# Altium schematic sheet R2.SchDoc
size A3; SheetNumber: 1; SheetTotal: 1
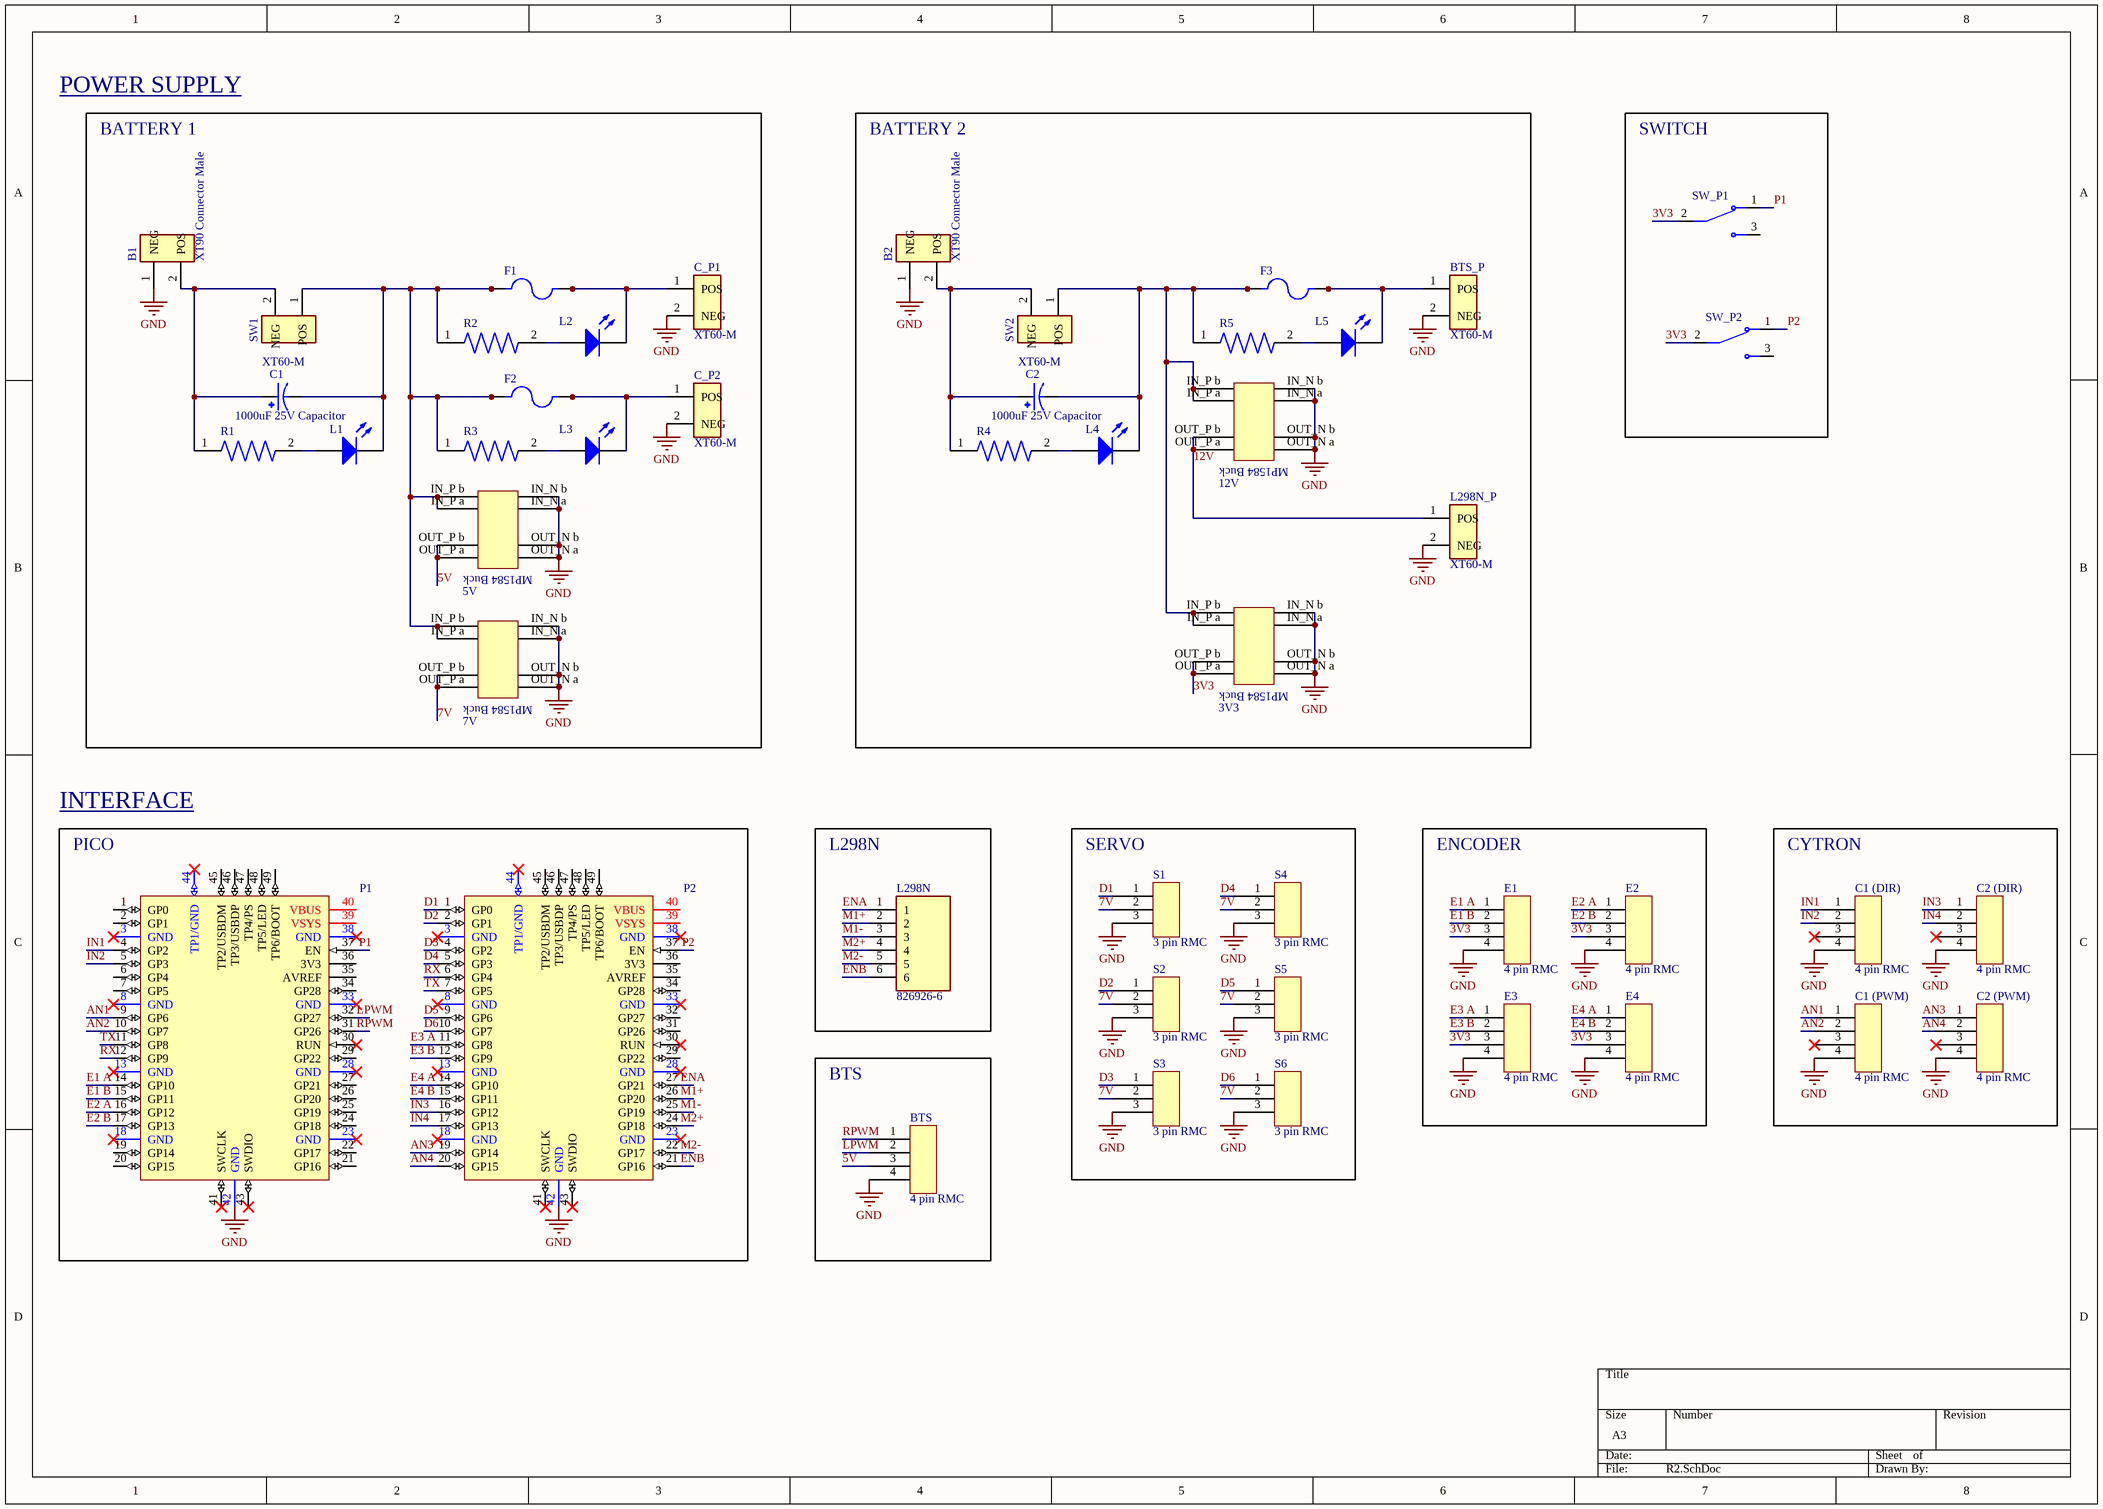
[diagram p0: R2.SchDoc]

## Parts
3V3  MP1584 mini buck module  [mp1584 mini buck]  (value not drawn)
5V  MP1584 mini buck module  [mp1584 mini buck]  (value not drawn)
7V  MP1584 mini buck module  [mp1584 mini buck]  (value not drawn)
12V  MP1584 mini buck module  [mp1584 mini buck]  (value not drawn)
B1  XT90-M  [XT90-M]  (value not drawn)
B2  XT90-M  [XT90-M]  (value not drawn)
BTS  4 pin RMC  [Header JST 1X04]
BTS_P  XT60-M  [XT-60M]
C1  1000uF 25V Capacitor  [1000uF 25V Capacitor]
C1_(DIR)  4 pin RMC  [Header JST 1X04]
C1_(PWM)  4 pin RMC  [Header JST 1X04]
C2  1000uF 25V Capacitor  [1000uF 25V Capacitor]
C2_(DIR)  4 pin RMC  [Header JST 1X04]
C2_(PWM)  4 pin RMC  [Header JST 1X04]
C_P1  XT60-M  [XT-60M]
C_P2  XT60-M  [XT-60M]
E1  4 pin RMC  [Header JST 1X04]
E2  4 pin RMC  [Header JST 1X04]
E3  4 pin RMC  [Header JST 1X04]
E4  4 pin RMC  [Header JST 1X04]
F1  3522-2  [FUSE_3522-2]  (value not drawn)
F2  3522-2  [FUSE_3522-2]  (value not drawn)
F3  3522-2  [FUSE_3522-2]  (value not drawn)
L1  151031SS04000 LED  [LED Type 3mm]  (value not drawn)
L2  151031SS04000 LED  [LED Type 3mm]  (value not drawn)
L3  151031SS04000 LED  [LED Type 3mm]  (value not drawn)
L4  151031SS04000 LED  [LED Type 3mm]  (value not drawn)
L5  151031SS04000 LED  [LED Type 3mm]  (value not drawn)
L298N  826926-6  [TE_826926-6]
L298N_P  XT60-M  [XT-60M]
P1  RPI-PICO-MOD  [RPI-PICO-MOD]  (value not drawn)
P2  RPI-PICO-MOD  [RPI-PICO-MOD]  (value not drawn)
R1  2-1623927-3  [RESAD700W45L350D185]  (value not drawn)
R2  2-1623927-3  [RESAD700W45L350D185]  (value not drawn)
R3  2-1623927-3  [RESAD700W45L350D185]  (value not drawn)
R4  2-1623927-3  [RESAD700W45L350D185]  (value not drawn)
R5  2-1623927-3  [RESAD700W45L350D185]  (value not drawn)
S1  3 pin RMC  [Header JST 1X03]
S2  3 pin RMC  [Header JST 1X03]
S3  3 pin RMC  [Header JST 1X03]
S4  3 pin RMC  [Header JST 1X03]
S5  3 pin RMC  [Header JST 1X03]
S6  3 pin RMC  [Header JST 1X03]
SW1  XT60-M  [XT-60M]
SW2  XT60-M  [XT-60M]
SW_P1  500SSP1S2M2QEA  [SW_500SSP1S2M2QEA]  (value not drawn)
SW_P2  500SSP1S2M2QEA  [SW_500SSP1S2M2QEA]  (value not drawn)

## Blocks framed on the sheet
BATTERY 1: 5V 7V B1 C1 C_P1 C_P2 F1 F2 L1-L3 R1-R3 SW1
BATTERY 2: 3V3 12V B2 BTS_P C2 F3 L4 L5 L298N_P R4 R5 SW2
SWITCH: SW_P1 SW_P2
INTERFACE: P1 P2
L298N: L298N
SERVO: S1-S6
ENCODER: E1-E4
CYTRON: C1_(DIR) C1_(PWM) C2_(DIR) C2_(PWM)
BTS: BTS

## Nets
GND: 3V3.IN_N_a 3V3.IN_N_b 3V3.OUT_N_a 3V3.OUT_N_b 5V.IN_N_a 5V.IN_N_b 5V.OUT_N_a 5V.OUT_N_b 7V.IN_N_a 7V.IN_N_b 7V.OUT_N_a 7V.OUT_N_b 12V.IN_N_a 12V.IN_N_b 12V.OUT_N_a 12V.OUT_N_b B1.1(NEG) B2.1(NEG) BTS.4 BTS_P.2(NEG) C1_(DIR).4 C1_(PWM).4 C2_(DIR).4 C2_(PWM).4 C_P1.2(NEG) C_P2.2(NEG) E1.4 E2.4 E3.4 E4.4 L298N_P.2(NEG) P1.42(GND) P2.42(GND) S1.3 S2.3 S3.3 S4.3 S5.3 S6.3
3V3: 3V3.OUT_P_a(OUT_P_b) 3V3.OUT_P_b E1.3 E2.3 E3.3 E4.3 SW_P1.2(COM) SW_P2.2(COM)
5V: 5V.OUT_P_a(OUT_P_b) 5V.OUT_P_b BTS.3
7V: 7V.OUT_P_a(OUT_P_b) 7V.OUT_P_b S1.2 S2.2 S3.2 S4.2 S5.2 S6.2
12V: 12V.OUT_P_a(OUT_P_b) 12V.OUT_P_b L298N_P.1(POS)
AN1: C1_(PWM).1 P1.9(GP6)
AN2: C1_(PWM).2 P1.10(GP7)
AN3: C2_(PWM).1 P2.19(GP14)
AN4: C2_(PWM).2 P2.20(GP15)
D1: P2.1(GP0) S1.1
D2: P2.2(GP1) S2.1
D3: P2.4(GP2) S3.1
D4: P2.5(GP3) S4.1
D5: P2.9(GP6) S5.1
D6: P2.10(GP7) S6.1
E1 A: E1.1 P1.14(GP10)
E1 B: E1.2 P1.15(GP11)
E2 A: E2.1 P1.16(GP12)
E2 B: E2.2 P1.17(GP13)
E3 A: E3.1 P2.11(GP8)
E3 B: E3.2 P2.12(GP9)
E4 A: E4.1 P2.14(GP10)
E4 B: E4.2 P2.15(GP11)
ENA: L298N.1 P2.27(GP21)
ENB: L298N.6 P2.21(GP16)
IN1: C1_(DIR).1 P1.4(GP2)
IN2: C1_(DIR).2 P1.5(GP3)
IN3: C2_(DIR).1 P2.16(GP12)
IN4: C2_(DIR).2 P2.17(GP13)
LPWM: BTS.2 P1.32(GP27)
M1+: L298N.2 P2.26(GP20)
M1-: L298N.3 P2.25(GP19)
M2+: L298N.4 P2.24(GP18)
M2-: L298N.5 P2.22(GP17)
P1: P1.37(EN) SW_P1.1(NC)
P2: P2.37(EN) SW_P2.1(NC)
RPWM: BTS.1 P1.31(GP26)
RX: P1.12(GP9) P2.6(GP4)
TX: P1.11(GP8) P2.7(GP5)
Net3V3_IN_P a: 3V3.IN_P_a 3V3.IN_P_b 12V.IN_P_a 12V.IN_P_b C2.N F3.1A F3.1B L4.1(K) R5.1 SW2.1(POS)
Net5V_IN_P a: 5V.IN_P_a 5V.IN_P_b 7V.IN_P_a 7V.IN_P_b C1.N F1.1A F1.1B F2.1A F2.1B L1.1(K) R2.1 R3.1 SW1.1(POS)
NetB1_2: B1.2(POS) C1.P R1.1 SW1.2(NEG)
NetB2_2: B2.2(POS) C2.P R4.1 SW2.2(NEG)
NetBTS_P_1: BTS_P.1(POS) F3.2A F3.2B L5.1(K)
NetC_P1_1: C_P1.1(POS) F1.2A F1.2B L2.1(K)
NetC_P2_1: C_P2.1(POS) F2.2A F2.2B L3.1(K)
NetL1_2: L1.2(A) R1.2
NetL2_2: L2.2(A) R2.2
NetL3_2: L3.2(A) R3.2
NetL4_2: L4.2(A) R4.2
NetL5_2: L5.2(A) R5.2

Not connected (* = marked no-connect by the designer): C1_(DIR) 3*; C1_(PWM) 3*; C2_(DIR) 3*; C2_(PWM) 3*; P1 1(GP0) 2(GP1) 3(GND)* 6(GP4) 7(GP5) 8(GND)* 13(GND)* 18(GND)* 19(GP14) 20(GP15) 21(GP16) 22(GP17) 23(GND)* 24(GP18) 25(GP19) 26(GP20) 27(GP21) 28(GND)* 29(GP22) 30(RUN)* 33(GND)* 34(GP28) 35(AVREF) 36(3V3) 38(GND)* 39(VSYS) 40(VBUS) 41(SWCLK)* 43(SWDIO)* 44(TP1/GND)* 45(TP2/USBDM) 46(TP3/USBDP) 47(TP4/PS) 48(TP5/LED) 49(TP6/BOOT); P2 3(GND)* 8(GND)* 13(GND)* 18(GND)* 23(GND)* 28(GND)* 29(GP22) 30(RUN)* 31(GP26) 32(GP27) 33(GND)* 34(GP28) 35(AVREF) 36(3V3) 38(GND)* 39(VSYS) 40(VBUS) 41(SWCLK)* 43(SWDIO)* 44(TP1/GND)* 45(TP2/USBDM) 46(TP3/USBDP) 47(TP4/PS) 48(TP5/LED) 49(TP6/BOOT); SW_P1 3(NO); SW_P2 3(NO)

## Notes on the sheet
- POWER SUPPLY
- (near P1) PICO
- (in symbol MP1584 mini buck module) MP1584 Buck
- (in symbol XT90-M) XT90 Connector Male

## Library data of the parts
BTS_P C_P1 C_P2 L298N_P SW1 SW2 = XT60-M: Plug; DC supply; XT60; male; PIN: 2; for cable; soldered; 30A; 500V; MF: AMASS; MP: XT60-M; Price: None; Package: Package Analog Devices; Value: *; Availability: Unavailable; SnapEDA_Link: https://www.snapeda.com/parts/XT60-M/AMASS/view-part/2883912/?ref=snap
C1 C2 = 1000uF 25V Capacitor: CAP ALUM 1000UF 20% 25V RADIAL; MP: EEUTA1E102LB; MF: Panasonic; Package: RADIAL-2 Panasonic; Availability: No availability data; Price: None; Check_prices: https://www.snapeda.com/parts/EEUTA1E102LB/Panasonic/view-part/5789306/?ref=eda; SnapEDA_Link: https://www.snapeda.com/parts/EEUTA1E102LB/Panasonic/view-part/5789306/?ref=snap; Value: *
F1-F3 = 3522-2: MF: {'manufacturer': u'Keystone Electronics'}; Availability: Unavailable; Price: None; Value: *; MP: 3522-2; Package: None
L1-L5 = 151031SS04000 LED: THT LED round mono-color color lens, WL-TMRW, Super Red; PackageReference: Type 3mm; Emitting color: Super Red; PartNumber: 151031SS04000; ComponentLink1Description: Manufacturer URL; ComponentLink1URL: http://www.we-online.com; ComponentLink2Description: Datasheet; ComponentLink2URL: http://katalog.we-online.de/pbs/datasheet/7448042001.pdfhttp://katalog.we-online.de/pbs/datasheet/7448042001.pdfhttp://katalog.we-online.de/pbs/datasheet/7448042001.pdfhttp://katalog.we-online.de/pbs/datasheet/151031SS04000.pdf
L298N = 826926-6: 6P AMPMODU II STIFT LEI; Centerline_Pitch: 2.54 mm[.1 in]; Product_Type: Connector; MF: TE Connectivity; Number_of_Positions: 6; MP: 826926-6; Availability: Unavailable; EU_RoHS_Compliance: Compliant; Package: None; Value: *; TE_purchase_URL: https://www.te.com/usa-en/product-826926-6.html?te_bu=Cor&te_type=disp&te_campaign=seda_glo_cor-seda-global-disp-prtnr-fy19-seda-model-bom-cta_sma-317_1&elqCampaignId=32493; Price: None; SnapEDA_Link: https://www.snapeda.com/parts/826926-6/TE%20Connectivity%20AMP%20Connectors/view-part/481382/?ref=snap
P1 P2 = RPI-PICO-MOD: RASPBERRY PI PICO RP2040 BOARD; Manufacturer: Raspberry Pi Foundation; Manufacturer Part No: SC0915; Mounting Technology: SMT; Supplier: DigiKey; Supplier Part No: 2648-SC0915CT-ND; Supplier Link: https://www.digikey.com/en/products/detail/raspberry-pi/SC0915/13684020
R1-R5 = 2-1623927-3: Carbon Film Resistors - Through Hole 1K Ohm 5% 1/4W Res Carbon Film; Voltage_Rating: 200 V; MF: TE Connectivity; Power_Rating: .25 W; Value: *; Tolerance: 5%; SnapEDA_Link: https://www.snapeda.com/parts/2-1623927-3/TE+Connectivity/view-part/?ref=snap; Resistance: 1K; Purchase-URL: https://pricing.snapeda.com/search/part/2-1623927-3/?ref=eda; EU_RoHS_Compliance: Compliant; Availability: In Stock; Price: None; Package: None; Check_prices: https://www.snapeda.com/parts/2-1623927-3/TE+Connectivity/view-part/?ref=eda; MP: 2-1623927-3
SW_P1 SW_P2 = 500SSP1S2M2QEA: Slide Switch SPDT Through Hole; Package: None; Value: *; Price: None; MP: 500SSP1S2M2QEA; Availability: Unavailable